# Altium project Otto.PrjPcb
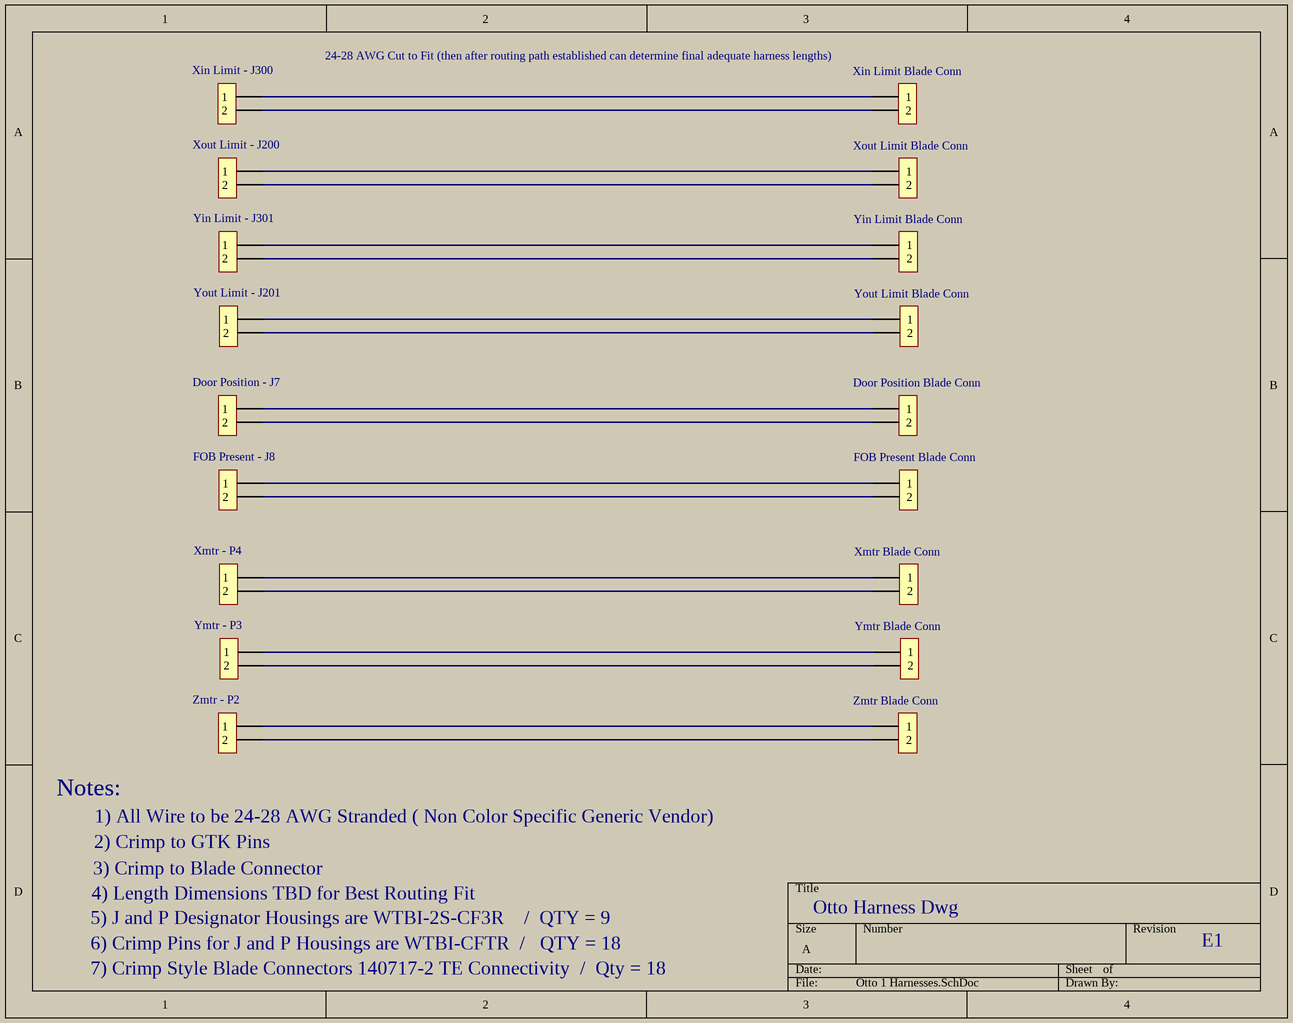
[diagram p0: Otto 1 Harnesses.SchDoc]
3 sheets, 159 parts. Net scope: flat (ports and power ports of the same name join across sheets).
Board file: OTTO.PcbDoc
Sheets:
  Otto 1 Harnesses.SchDoc
  Otto 2.SchDoc
  Otto 1.SchDoc

## Sheet Otto 1 Harnesses.SchDoc
size A

### Parts
Door_Position_-_J7  1mm 2 pin Housing  (value not drawn)
Door_Position_Blade_Conn  Crimp Blade Conn  [GTK-2]  (value not drawn)
FOB_Present_-_J8  1mm 2 pin Housing  (value not drawn)
FOB_Present_Blade_Conn  Crimp Blade Conn  [GTK-2]  (value not drawn)
Xin_Limit_-_J300  1mm 2 pin Housing  (value not drawn)
Xin_Limit_Blade_Conn  Crimp Blade Conn  [GTK-2]  (value not drawn)
Xmtr_-_P4  1mm 2 pin Housing  (value not drawn)
Xmtr_Blade_Conn  Crimp Blade Conn  [GTK-2]  (value not drawn)
Xout_Limit_-_J200  1mm 2 pin Housing  (value not drawn)
Xout_Limit_Blade_Conn  Crimp Blade Conn  [GTK-2]  (value not drawn)
Yin_Limit_-_J301  1mm 2 pin Housing  (value not drawn)
Yin_Limit_Blade_Conn  Crimp Blade Conn  [GTK-2]  (value not drawn)
Ymtr_-_P3  1mm 2 pin Housing  (value not drawn)
Ymtr_Blade_Conn  Crimp Blade Conn  [GTK-2]  (value not drawn)
Yout_Limit_-_J201  1mm 2 pin Housing  (value not drawn)
Yout_Limit_Blade_Conn  Crimp Blade Conn  [GTK-2]  (value not drawn)
Zmtr_-_P2  1mm 2 pin Housing  (value not drawn)
Zmtr_Blade_Conn  Crimp Blade Conn  [GTK-2]  (value not drawn)

### Nets
NetDoor_Position_-_J7_1: Door_Position_-_J7.1 Door_Position_Blade_Conn.1
NetDoor_Position_-_J7_2: Door_Position_-_J7.2 Door_Position_Blade_Conn.2
NetFOB_Present_-_J8_1: FOB_Present_-_J8.1 FOB_Present_Blade_Conn.1
NetFOB_Present_-_J8_2: FOB_Present_-_J8.2 FOB_Present_Blade_Conn.2
NetXin_Limit_-_J300_1: Xin_Limit_-_J300.1 Xin_Limit_Blade_Conn.1
NetXin_Limit_-_J300_2: Xin_Limit_-_J300.2 Xin_Limit_Blade_Conn.2
NetXmtr_-_P4_1: Xmtr_-_P4.1 Xmtr_Blade_Conn.1
NetXmtr_-_P4_2: Xmtr_-_P4.2 Xmtr_Blade_Conn.2
NetXout_Limit_-_J200_1: Xout_Limit_-_J200.1 Xout_Limit_Blade_Conn.1
NetXout_Limit_-_J200_2: Xout_Limit_-_J200.2 Xout_Limit_Blade_Conn.2
NetYin_Limit_-_J301_1: Yin_Limit_-_J301.1 Yin_Limit_Blade_Conn.1
NetYin_Limit_-_J301_2: Yin_Limit_-_J301.2 Yin_Limit_Blade_Conn.2
NetYmtr_-_P3_1: Ymtr_-_P3.1 Ymtr_Blade_Conn.1
NetYmtr_-_P3_2: Ymtr_-_P3.2 Ymtr_Blade_Conn.2
NetYout_Limit_-_J201_1: Yout_Limit_-_J201.1 Yout_Limit_Blade_Conn.1
NetYout_Limit_-_J201_2: Yout_Limit_-_J201.2 Yout_Limit_Blade_Conn.2
NetZmtr_-_P2_1: Zmtr_-_P2.1 Zmtr_Blade_Conn.1
NetZmtr_-_P2_2: Zmtr_-_P2.2 Zmtr_Blade_Conn.2

### Notes on the sheet
- (near Xin_Limit_Blade_Conn) 24-28 AWG Cut to Fit (then after routing path established can determine final adequate harness lengths)
- Notes:
- 1) All Wire to be 24-28 AWG Stranded ( Non Color Specific Generic Vendor)
- 4) Length Dimensions TBD for Best Routing Fit
- 3) Crimp to Blade Connector
- 2) Crimp to GTK Pins
- 5) J and P Designator Housings are WTBI-2S-CF3R    /  QTY = 9
- 6) Crimp Pins for J and P Housings are WTBI-CFTR  /   QTY = 18
- 7) Crimp Style Blade Connectors 140717-2 TE Connectivity  /  Qty = 18
- Otto Harness Dwg
- E1

### Library data of the parts
Door_Position_-_J7 FOB_Present_-_J8 Xin_Limit_-_J300 Xmtr_-_P4 Xout_Limit_-_J200 Yin_Limit_-_J301 Ymtr_-_P3 Yout_Limit_-_J201 Zmtr_-_P2 = 2 PIN .1mm GTK Header: WTBI-02S-CF3R  2pin 1mm center GTK Housing
Door_Position_Blade_Conn FOB_Present_Blade_Conn Xin_Limit_Blade_Conn Xmtr_Blade_Conn Xout_Limit_Blade_Conn Yin_Limit_Blade_Conn Ymtr_Blade_Conn Yout_Limit_Blade_Conn Zmtr_Blade_Conn = 2 PIN .1mm GTK Header: 140717-2 TE Connectivity

## Sheet Otto 2.SchDoc
size B
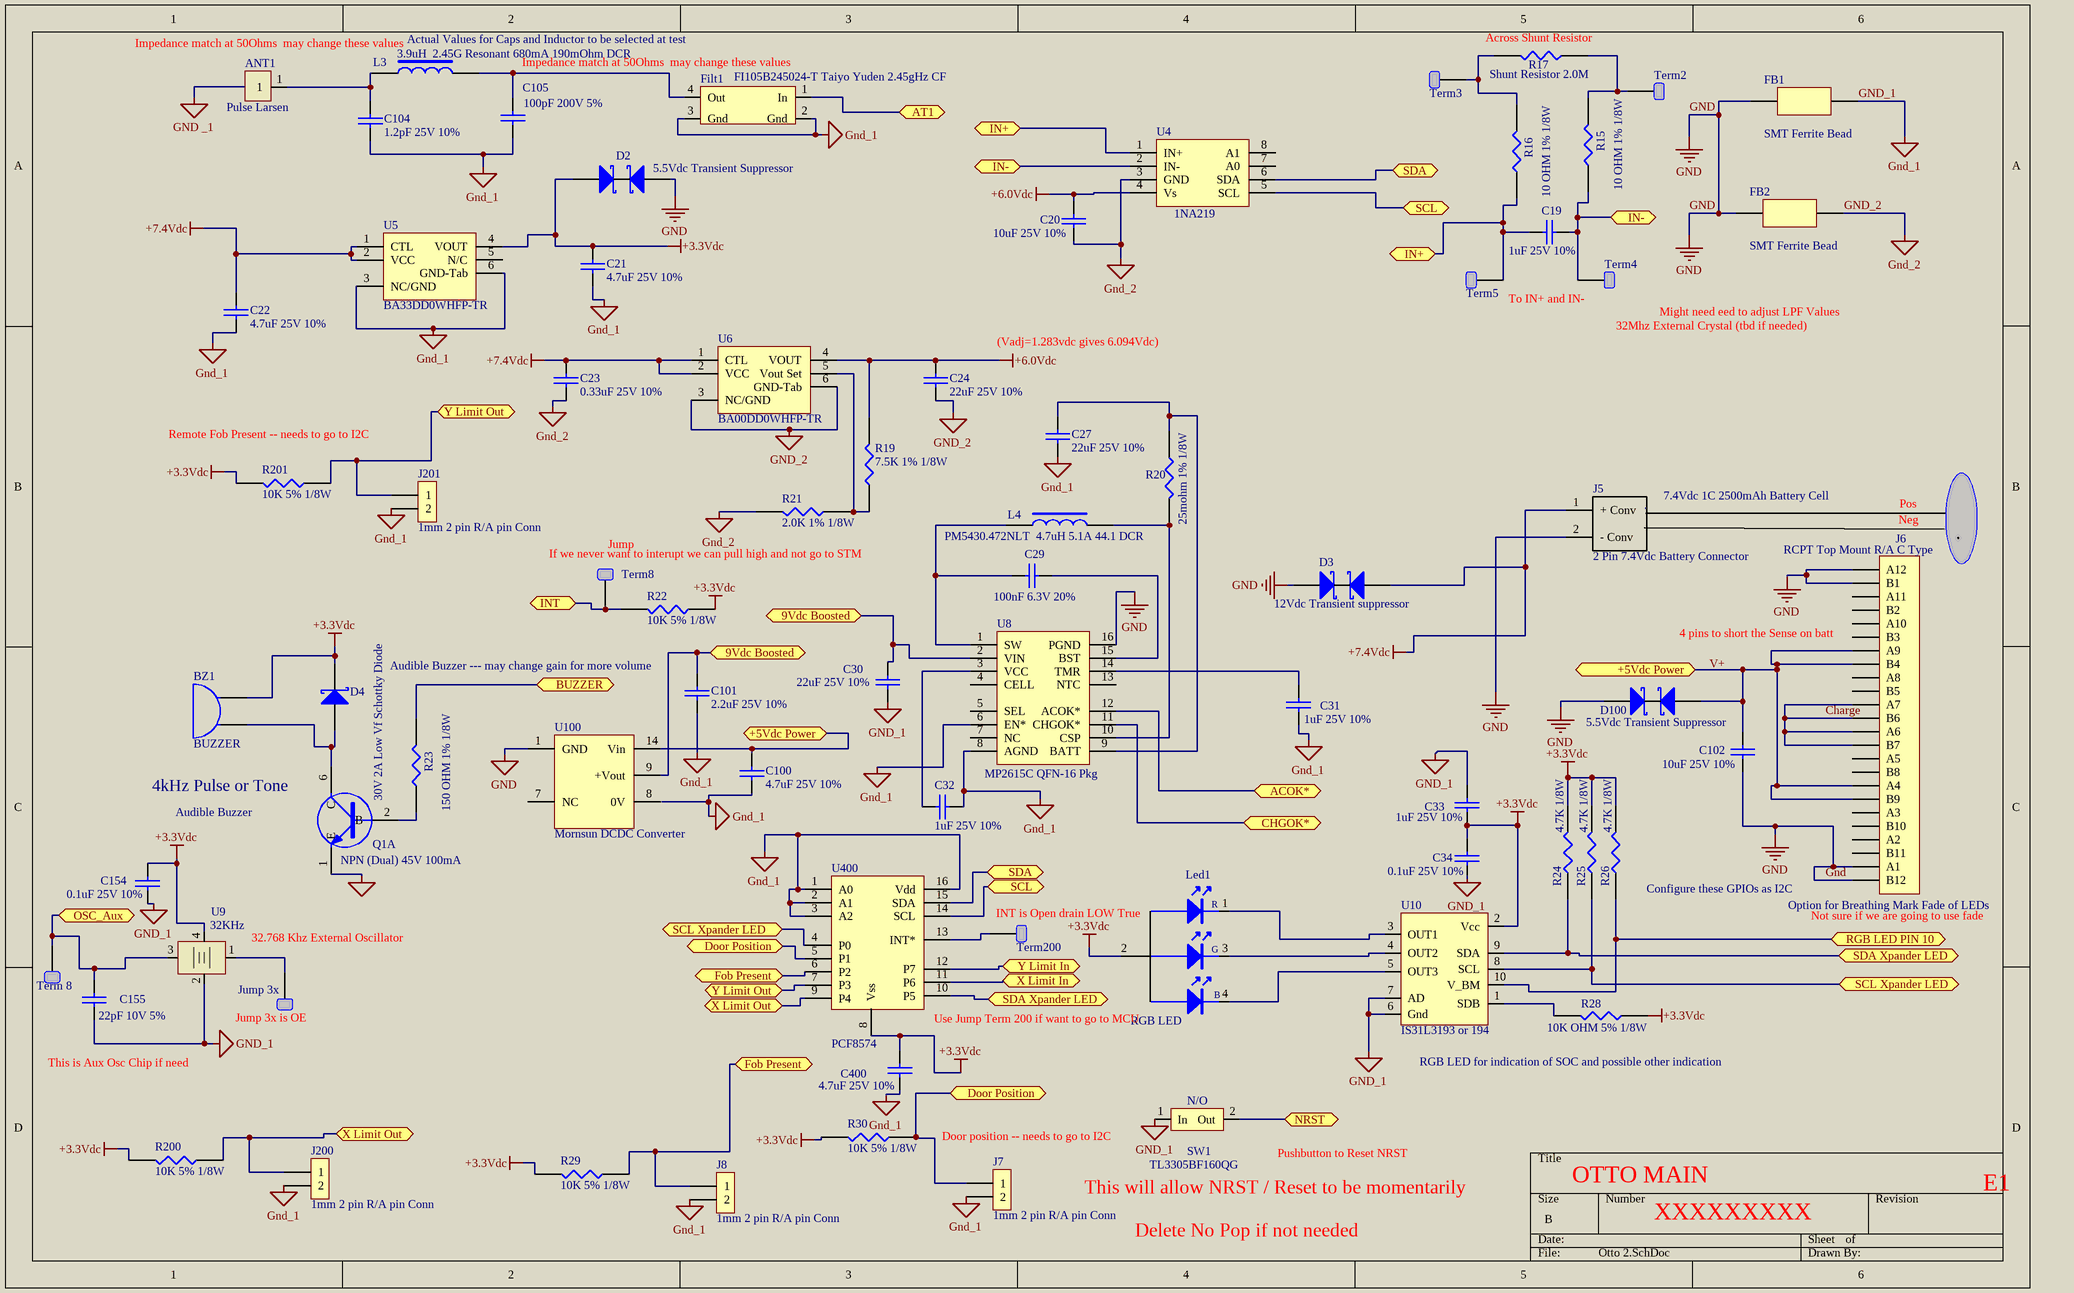
[diagram p1: Otto 2.SchDoc]

### Parts
ANT1  Pulse Larsen  [Pulse Larsen - duplicate]
BZ1  BUZZER  [BUZZER-smd]
C19  1uF 25V 10%  [0603]
C20  10uF 25V 10%  [BEADC3225X280N]
C21  4.7uF 25V 10%  [0603]
C22  4.7uF 25V 10%  [0603]
C23  0.33uF 25V 10%  [0603]
C24  22uF 25V 10%  [C1210]
C27  22uF 25V 10%  [C1210]
C29  100nF 6.3V 20%  [0603]
C30  22uF 25V 10%  [C1210]
C31  1uF 25V 10%  [0603]
C32  1uF 25V 10%  [0603]
C33  1uF 25V 10%  [0603]
C34  0.1uF 25V 10%  [0402]
C100  4.7uF 25V 10%  [0603]
C101  2.2uF 25V 10%  [0603]
C102  10uF 25V 10%  [BEADC3225X280N]
C104  1.2pF 25V 10%  [0402]
C105  100pF 200V 5%  [0603]
C154  0.1uF 25V 10%  [0402]
C155  22pF 10V 5%  [0805]
C400  4.7uF 25V 10%  [0603]
D2  5.5Vdc Transient Suppressor  [TDK-TVS]
D3  12Vdc Transient suppressor  [VS12BA-TVS]
D4  30V 2A Low Vf Schottky Diode  [SOD 123]
D100  5.5Vdc Transient Suppressor  [TDK-TVS]
FB1  Max DCR 0.05ohm  3A  [0805]  (value not drawn)
FB2  Max DCR 0.05ohm  3A  [0805]  (value not drawn)
Filt1  FI105B245024-T Taiyo Yuden 2.45gHz CF  [Filter]
J5  2 Pin 7.4Vdc Battery Connector  [GTK 2 pin Batt  RA]
J6  RCPT Top Mount R/A C Type  [C-Conn]
J7  1mm 2 pin R/A pin Conn  [GTK-2]
J8  1mm 2 pin R/A pin Conn  [GTK-2]
J200  1mm 2 pin R/A pin Conn  [GTK-2]
J201  1mm 2 pin R/A pin Conn  [GTK-2]
Jump_3x  Hook Up Terminal  [Pad]  (value not drawn)
L3  3.9uH  2.45G Resonant 680mA 190mOhm DCR  [0603]
L4  PM5430.472NLT  4.7uH 5.1A 44.1 DCR  [Pulse 3A5430]
Led1  RGB LED  [4P RGB LED]
Q1  NPN (Dual) 45V 100mA  [SOT-363]  (part A of 2)
R15  10 OHM 1% 1/8W  [0805]
R16  10 OHM 1% 1/8W  [0805]
R17  Shunt Resistor 2.0M  [2512]
R19  7.5K 1% 1/8W  [0805]
R20  25mohm 1% 1/8W  [0805]
R21  2.0K 1% 1/8W  [0805]
R22  10K 5% 1/8W  [0805]
R23  150 OHM 1% 1/8W  [0805]
R24  4.7K 1/8W  [0805]
R25  4.7K 1/8W  [0805]
R26  4.7K 1/8W  [0805]
R28  10K OHM 5% 1/8W  [0805]
R29  10K 5% 1/8W  [0805]
R30  10K 5% 1/8W  [0805]
R200  10K 5% 1/8W  [0805]
R201  10K 5% 1/8W  [0805]
SW1  TL3305BF160QG  [Switch]
Term2  Hook Up Terminal  [Pad]  (value not drawn)
Term3  Hook Up Terminal  [Pad]  (value not drawn)
Term4  Hook Up Terminal  [Pad]  (value not drawn)
Term5  Hook Up Terminal  [Pad]  (value not drawn)
Term8  Hook Up Terminal  [Pad]  (value not drawn)
Term200  Hook Up Terminal  [Pad]  (value not drawn)
Term_8  Hook Up Terminal  [Pad]  (value not drawn)
U4  1NA219  [INA219]
U5  BA33DD0WHFP-TR  [HRP-5]
U6  BA00DD0WHFP-TR  [HRP-5]
U8  MP2615C QFN-16 Pkg  [QFN-16]
U9  32KHz  [XTAL AND OSC]
U10  IS31L3193 or 194  [DFN-10]
U100  Mornsun DCDC Converter  [B0509D-2WR3]
U400  PCF8574  [SOIC-16]

### Ports
9Vdc Boosted (bidir), +5Vdc Power (bidir), ACOK* (bidir), AT1 (bidir), BUZZER (bidir), CHGOK* (bidir), Door Position (bidir), Fob Present, Fob Present (bidir), IN+ (bidir), IN- (bidir), INT (bidir), NRST (bidir), OSC_Aux (bidir), RGB LED PIN 10 (bidir), SCL (bidir), SCL Xpander LED (bidir), SDA (bidir), SDA Xpander LED (bidir), X Limit In (bidir), X Limit Out (bidir), Y Limit In (bidir), Y Limit Out (bidir)

### Nets
+3.3Vdc: BZ1.2(B) C21.2 C33.2 C34.1 C154.1 C400.2 D2.1 D4.1 Led1.2 R22.1 R24.2 R25.2 R26.2 R28.2 R29.2 R30.2 R200.2 R201.2 U5.4(VOUT) U9.4 U10.2(Vcc) U400.8(Vss)
+6.0Vdc: C20.1 C24.2 R19.2 U4.4(Vs) U6.4(VOUT)
+7.4Vdc: C22.2 C23.2 D3.2 J5.1(+_Conv) U5.1(CTL) U5.2(VCC) U6.1(CTL) U6.2(VCC)
GND: C102.2 D2.2 D3.1 D100.1 FB1.1 FB2.1 J5.2(-_Conv) J6.A1 J6.A12 J6.B1 J6.B12 U8.16(PGND) U100.1(GND)
GND_1: C21.1 C22.1 C27.1 C30.1 C31.2 C32.2 C33.1 C34.2 C100.1 C101.1 C104.2 C105.2 C154.2 C155.2 C400.1 FB1.2 Filt1.2(Gnd) Filt1.3(Gnd) J7.2 J8.2 J200.2 J201.2 Q1.1(E) SW1.1(In) U5.3(NC/GND) U5.6(GND-Tab) U8.6(EN*) U8.8(AGND) U9.2 U10.6(Gnd) U10.7(AD) U400.1(A0) U400.2(A1) U400.3(A2) U400.16(Vdd)
GND_2: C20.2 C23.1 C24.1 FB2.2 R21.2 U4.3(GND) U6.3(NC/GND) U6.6(GND-Tab)
Charge: J6.A6 J6.A7 J6.B6 J6.B7
NetANT1_1: ANT1.1 C104.1 L3.1
NetBZ1_1: BZ1.1(A) D4.2 Q1.6(C)
NetC14_1: SW1.2(Out) ; port NRST
NetC19_1: C19.1 R16.1 Term5.1 U4.1(IN+) ; port IN+
NetC19_2: C19.2 R15.1 Term4.1 U4.2(IN-) ; port IN-
NetC27_2: C27.2 R20.1 U8.9(BATT)
NetC29_1: C29.1 U8.15(BST)
NetC29_2: C29.2 L4.1 U8.1(SW)
NetC30_2: C30.2 C101.2 U8.2(VIN) U100.9(+Vout) ; port 9Vdc Boosted
NetC31_1: C31.1 U8.14(TMR)
NetC32_1: C32.1 U8.3(VCC)
NetC100_2: C100.2 C102.1 D100.2 J6.A4 J6.A9 J6.B4 J6.B9 U100.14(Vin) ; port +5Vdc Power
NetC105_1: C105.1 Filt1.4(Out) L3.2
NetC155_1: C155.1 Term_8.1 U9.3 ; port OSC_Aux
NetFilt1_1: Filt1.1(In) ; port AT1
NetJ7_1: J7.1 R30.1 U400.5(P1) ; port Door Position
NetJ8_1: J8.1 R29.1 U400.6(P2) ; port Fob Present
NetJ200_1: J200.1 R200.1 U400.9(P4) ; port X Limit Out
NetJ201_1: J201.1 R201.1 U400.7(P3) ; port Y Limit Out
NetJ300_1: U400.11(P6) ; port X Limit In
NetJ301_1: U400.12(P7) ; port Y Limit In
NetJump_3x_1: Jump_3x.1 U9.1
NetL4_2: L4.2 R20.2 U8.10(CSP)
NetLed1_1: Led1.1(R) U10.3(OUT1)
NetLed1_3: Led1.3(G) U10.4(OUT2)
NetLed1_4: Led1.4(G) U10.5(OUT3)
NetQ1_2: Q1.2(B) R23.1
NetR15_2: R15.2 R17.1 Term2.1
NetR16_2: R16.2 R17.2 Term3.1
NetR19_1: R19.1 R21.1 U6.5(Vout_Set)
NetR22_2: R22.2 Term8.1 ; port INT
NetR23_2: R23.2 ; port BUZZER
NetR24_1: R24.1 U10.9(SDA) U400.10(P5) ; port SDA Xpander LED
NetR25_1: R25.1 U10.8(SCL) U400.4(P0) ; port SCL Xpander LED
NetR26_1: R26.1 U10.10(V_BM) ; port RGB LED PIN 10
NetR28_1: R28.1 U10.1(SDB)
NetTerm200_1: Term200.1 U400.13(INT*)
NetU1_16: U4.5(SCL) U400.14(SCL) ; port SCL
NetU1_17: U8.11(CHGOK*) ; port CHGOK*
NetU1_44: U4.6(SDA) U400.15(SDA) ; port SDA
NetU1_45: U8.12(ACOK*) ; port ACOK*

Not connected (* = marked no-connect by the designer): J6 A2 A3 A5 A8 A10 A11 B2 B3 B5 B8 B10 B11; U4 7(A0) 8(A1); U5 5(N/C); U8 4(CELL) 5(SEL) 7(NC) 13(NTC); U100 7(NC) 8(0V)

### Notes on the sheet
- Impedance match at 50Ohms  may change these values
- (near L3) Actual Values for Caps and Inductor to be selected at test
- (near R17) Across Shunt Resistor
- (near Term4) To IN+ and IN-
- (Vadj=1.283vdc gives 6.094Vdc)
- (near Term4) 32Mhz External Crystal (tbd if needed)
- Might need eed to adjust LPF Values
- Remote Fob Present -- needs to go to I2C
- 7.4Vdc 1C 2500mAh Battery Cell
- Pos
- (near Term8) If we never want to interupt we can pull high and not go to STM
- (near Term8) Jump
- (near J6) Neg
- (near J6) 4 pins to short the Sense on batt
- (near C101) Audible Buzzer --- may change gain for more volume
- (near Q1) 4kHz Pulse or Tone
- Audible Buzzer
- (near R26) Configure these GPIOs as I2C
- (near J6) Option for Breathing Mark Fade of LEDs
- (near U9) 32.768 Khz External Oscillator
- (near Led1) INT is Open drain LOW True
- (near J6) Not sure if we are going to use fade
- (near Jump_3x) Jump 3x is OE
- Use Jump Term 200 if want to go to MCU
- (near C155) This is Aux Osc Chip if need
- RGB LED for indication of SOC and possible other indication
- (near SW1) Door position -- needs to go to I2C
- Pushbutton to Reset NRST
- This will allow NRST / Reset to be momentarily
- Delete No Pop if not needed
- OTTO MAIN
- XXXXXXXXX
- E1
- Labels drawn without touching a wire or pin: V+
- (in symbol RGB LED) B
- (in symbol SPSP Switch) N/O

### Library data of the parts
ANT1 = ANT: W3230 Pulse Larsen BLE 2.5Ghz 2.57 at Digikey
BZ1 = BUZZER: KLJ-5030 (Keliking) 4kHz Buzzer 71 cents from LcSc.com
C19 C31-C33 = CAP: CC0603KRX5R8BB105 1uf 25V 10% Yageo 3 cents at Mouser
C20 C102 = CAP: CC1210KFX7R8BB106 Yageo 10uF 25V 10% 23 cents at Mouser
C21 C22 C100 C400 = CAP: GRM188R61E475KE11D Murata 4.7uF 25V 10% 7.9 centsat Mouser
C23 = CAP: C1608X7R1E334K080AC 0.33uF 25V 10% 2.8 cents at Mouser
C24 C27 C30 = CAP: TMK325B7226KM8P Taito Uden 22uF 25V X7R 10%    47cents at Mouser
C29 = CAP: 06036C104MAZ2A Kyocera 100nf 6.3V 20% 12 cents at Mouse
C34 C154 = CAP: TMK105BJ104KV8F Taiyo Uden 0.1uF 25V 10% 2.3 cents at Mouser
C101 = CAP: GRM188C71E225KE11J 2.2uF 25V 10% 0.19 usd @digikey
C104 = CAP: VJ0402A1R2BXXCW1BC  Vishay 13 cents at Mouser
C105 = CAP: C0603C101J2GACAUTO Kemet 5% 200V 0603 12 cents at Mouser
C155 = CAP: C0805C220J8GACAUTO Kemet 0805 22pF 5% 7 cents at Mouser
D2 D100 = X1-DFN1006-2: B74111U0055M060  TDK 5.5vdc Supressor 3cents at Mouser
D3 = VS12VBA1HST15R: VS12VBA1HST15R  Rohm 12Vdc Transient Supressor 5cents at Digikey
D4 = DIODE SCHOTTKY: MBR230LSFT1G On Semi 2A 30V Diode SOD 123 23 cents at Newark
FB1 FB2 = FERRITE BEAD: 2508051217Z3 (Fair-Rite) 4.8 cents at Mouser; Text Field1: SMT Ferrite Bead
Filt1 = Filter RF: FI105B245024-T Taiyo Uuden RF 2.45gHz  Filter 4 pin smd 37 cents at Digikey
J5 = 2 PIN .1"  HDR: 640457-2  TE Connectivity 2 pin r-a battery conn 8.6cents at Mouser
J6 = C-Type Conn: USB3CF24M-H05 (HJC Conectors)
J7 J8 J200 J201 = 2 PIN .1mm GTK Receptacle_1: WTBI-02S-CF3-R 5 pin R-A 1mm center GTK Receptacle
L3 = INDUCTOR2: 0603HP-39NXGLU CoilCraft  190mOhm 680mA 2.45Ghz Resonant
L4 = INDUCTOR2: PM5430.472NLT  4.7uH 5.1A 44.1 DCR Ohms 20% 80 Cents at Digikey
Led1 = RGB LED: 521-8559F Dialight $p RGB 5mm Common Anode through hole 26 cents at Mouser
Q1 = SOT-363: BC847BS,115 Nexperia Dual NPN 8.9cents at Mouser
R15 R16 = RES1: CMP0805-FX-10R0ELF Bournes 10 ohm 1% .125 2.4 cents at Mouser
R17 = RES1: PSR100KTQFJ2L00 64cents at Mouser
R19 = RES1: KTR10EZPF7501 Rohm 7,5K 1% 3 cents at Mouser
R20 = RES1: CRF0805-FZ-R025ELF 25mohm 1% Current Shunt Resistor 16 cents at Mouser
R21 = RES1: SDR10EZPF2001 Rohm 2.0k 1% 2.1 cents at Mouser
R22 R29 R30 R200 R201 = RES1: CRCW080510K0JNEAC  5% .125 .8cents at Mouser
R23 = RES1: RC0805FR-07150RL  Yageo 150ohm 1% .125 1.6 cents at Digikey
R24-R26 = RES1: RC0805JR-074K7L Yageo 4.7K .125 10% 11 cents at Mouser
R28 = RES1: R0805JR-0710KL Yageo 10k .125 5% 27 cents at Digikey
SW1 = SPSP Switch: TL3305BF160QG SPST E-Switch Pushbutton Normally Open Tactile 1.5cents at Mouser
U4 = 1NA219: INA219AIDCNR Current Sensor  1.29 sd at mouser
U5 = 3.3 Fixed LDO: BA33DD0WHFP-TR 3.3Vdc LDO Rohm 2.15 usd at mouser
U6 = 6.0 Vdc LDO: BA00DD0WHFP-TR 6.0Vdc LDO Rohm  1.24 usd at mouser
U8 = MP2615C: MP2615C Batt Charger IC usd at mouser
U9 = XTAL: Pericom 3270004 32KhZ
U10 = IS31FL3193 RGB Drive: IS31FL3194-CLS2-TR RGB Driver 62 cents at Mouser also look at IS31FL3193 part
U100 = B0509D- 2WR3: B0509D- 2WR3  DC to DC Boost 5 to 9Vdc 2.80 at Digikey
U400 = PCF8574: PCF8574 I2C Expander  fix   usd at mouser

## Sheet Otto 1.SchDoc
size B
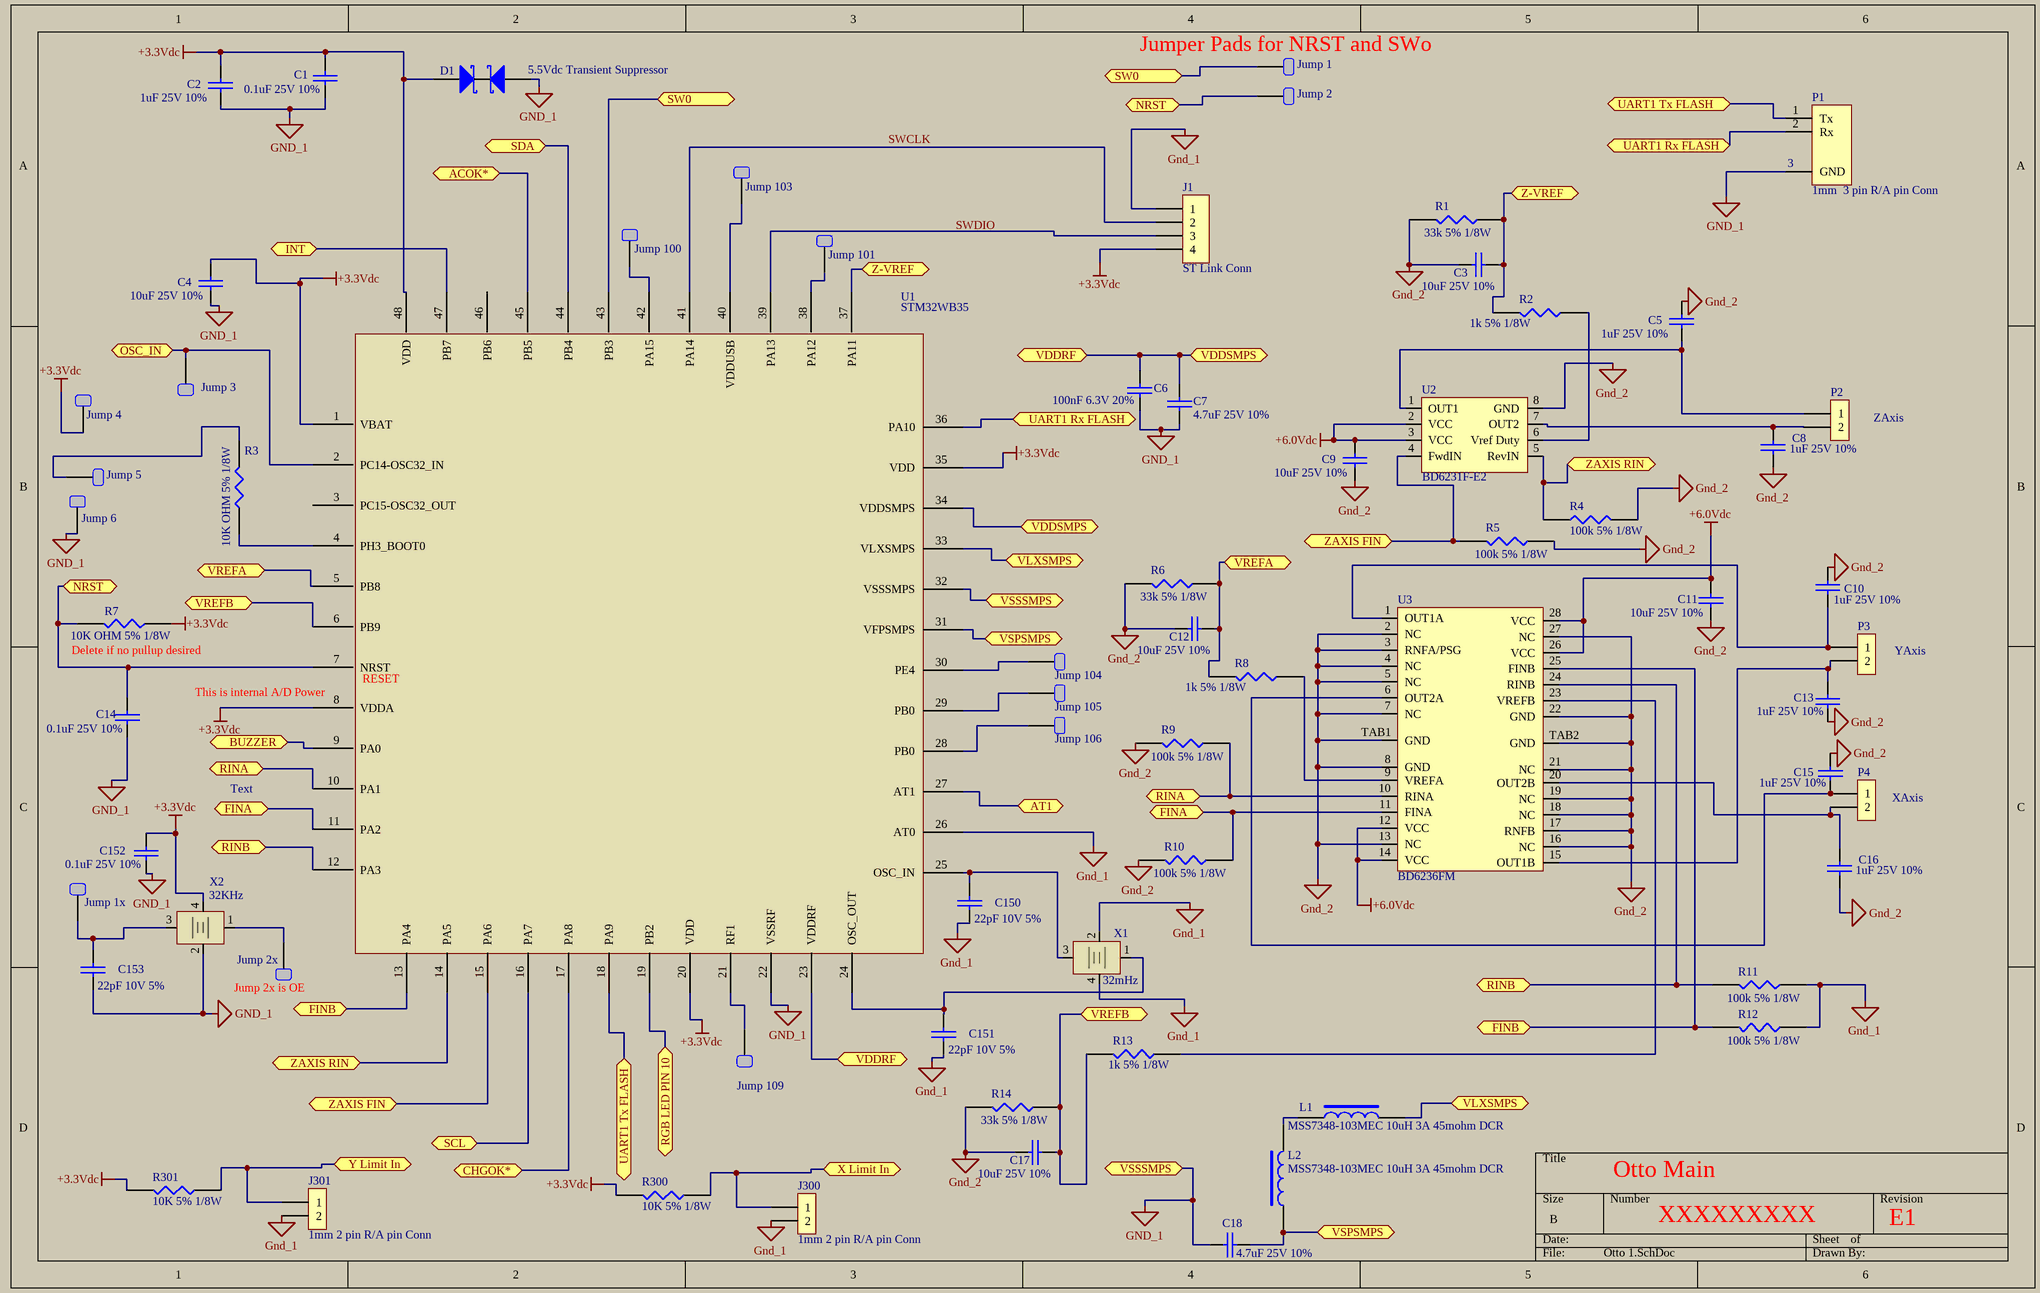
[diagram p2: Otto 1.SchDoc]

### Parts
C1  0.1uF 25V 10%  [0402]
C2  1uF 25V 10%  [0603]
C3  10uF 25V 10%  [BEADC3225X280N]
C4  10uF 25V 10%  [BEADC3225X280N]
C5  1uF 25V 10%  [0603]
C6  100nF 6.3V 20%  [0603]
C7  4.7uF 25V 10%  [0603]
C8  1uF 25V 10%  [0603]
C9  10uF 25V 10%  [BEADC3225X280N]
C10  1uF 25V 10%  [0603]
C11  10uF 25V 10%  [BEADC3225X280N]
C12  10uF 25V 10%  [BEADC3225X280N]
C13  1uF 25V 10%  [0603]
C14  0.1uF 25V 10%  [0402]
C15  1uF 25V 10%  [0603]
C16  1uF 25V 10%  [0603]
C17  10uF 25V 10%  [BEADC3225X280N]
C18  4.7uF 25V 10%  [0603]
C150  22pF 10V 5%  [0805]
C151  22pF 10V 5%  [0805]
C152  0.1uF 25V 10%  [0402]
C153  22pF 10V 5%  [0805]
D1  5.5Vdc Transient Suppressor  [TDK-TVS]
J1  ST Link Conn  [CONN-4]
J300  1mm 2 pin R/A pin Conn  [GTK-2]
J301  1mm 2 pin R/A pin Conn  [GTK-2]
Jump_1  Hook Up Terminal  [Pad]  (value not drawn)
Jump_1x  Hook Up Terminal  [Pad]  (value not drawn)
Jump_2  Hook Up Terminal  [Pad]  (value not drawn)
Jump_2x  Hook Up Terminal  [Pad]  (value not drawn)
Jump_3  Hook Up Terminal  [Pad]  (value not drawn)
Jump_4  Hook Up Terminal  [Pad]  (value not drawn)
Jump_5  Hook Up Terminal  [Pad]  (value not drawn)
Jump_6  Hook Up Terminal  [Pad]  (value not drawn)
Jump_100  Hook Up Terminal  [Pad]  (value not drawn)
Jump_101  Hook Up Terminal  [Pad]  (value not drawn)
Jump_103  Hook Up Terminal  [Pad]  (value not drawn)
Jump_104  Hook Up Terminal  [Pad]  (value not drawn)
Jump_105  Hook Up Terminal  [Pad]  (value not drawn)
Jump_106  Hook Up Terminal  [Pad]  (value not drawn)
Jump_109  Hook Up Terminal  [Pad]  (value not drawn)
L1  MSS7348-103MEC 10uH 3A 45mohm DCR  [Coilcraft 7x7 Inductor]
L2  MSS7348-103MEC 10uH 3A 45mohm DCR  [Coilcraft 7x7 Inductor]
P1  1mm  3 pin R/A pin Conn  [GTK 3pin 1mm Header]
P2  1mm 2 pin R/A pin Conn  [GTK-2]  (value not drawn)
P3  1mm 2 pin R/A pin Conn  [GTK-2]  (value not drawn)
P4  1mm 2 pin R/A pin Conn  [GTK-2]  (value not drawn)
R1  33k 5% 1/8W  [0805]
R2  1k 5% 1/8W  [0805]
R3  10K OHM 5% 1/8W  [0805]
R4  100k 5% 1/8W  [0805]
R5  100k 5% 1/8W  [0805]
R6  33k 5% 1/8W  [0805]
R7  10K OHM 5% 1/8W  [0805]
R8  1k 5% 1/8W  [0805]
R9  100k 5% 1/8W  [0805]
R10  100k 5% 1/8W  [0805]
R11  100k 5% 1/8W  [0805]
R12  100k 5% 1/8W  [0805]
R13  1k 5% 1/8W  [0805]
R14  33k 5% 1/8W  [0805]
R300  10K 5% 1/8W  [0805]
R301  10K 5% 1/8W  [0805]
U1  STM32WB35  [QFN50P700X700X65-49N-D]
U2  BD6231F-E2  [SOP-8]
U3  BD6236FM  [HSOP-M28]
X1  32mHz  [XTAL AND OSC]
X2  32KHz  [XTAL AND OSC]

### Ports
ACOK* (bidir), AT1 (bidir), BUZZER (bidir), CHGOK* (bidir), FINA (bidir), FINB (bidir), INT (bidir), NRST (bidir), OSC_IN (bidir), RGB LED PIN 10 (bidir), RINA (bidir), RINB (bidir), SCL (bidir), SDA (bidir), SW0 (bidir), UART1 Rx FLASH (bidir), UART1 Tx FLASH (bidir), VDDRF (bidir), VDDSMPS (bidir), VLXSMPS (bidir), VREFA (bidir), VREFB (bidir), VSPSMPS (bidir), VSSSMPS (bidir), X Limit In (bidir), Y Limit In (bidir), Z-VREF (bidir), ZAXIS FIN (bidir), ZAXIS RIN (bidir)

### Nets
+3.3Vdc: C1.1 C2.1 C4.1 C152.1 D1.1 J1.4 Jump_4.1 R7.2 R300.2 R301.2 U1.1(VBAT) U1.8(VDDA) U1.20(VDD) U1.35(VDD) U1.48(VDD) X2.4
+6.0Vdc: C9.1 C11.1 U2.2(VCC) U2.3(VCC) U3.12(VCC) U3.14(VCC) U3.26(VCC) U3.28(VCC)
GND_1: C1.2 C2.2 C4.2 C6.2 C7.1 C14.2 C18.1 C150.2 C151.2 C152.2 C153.2 D1.2 J1.1 J300.2 J301.2 Jump_6.1 P1.2(GND) R11.1 R12.1 U1.22(VSSRF) U1.26(AT0) U1.32(VSSSMPS) X1.2 X1.4 X2.2 ; port VSSSMPS
GND_2: C3.1 C5.1 C8.2 C9.2 C10.1 C11.2 C12.1 C13.2 C15.1 C16.2 C17.1 R1.2 R4.2 R5.1 R6.2 R9.2 R10.2 R14.2 U2.8(GND) U3.2(NC) U3.3(RNFA/PSG) U3.4(NC) U3.5(NC) U3.7(NC) U3.8(GND) U3.13(NC) U3.16(NC) U3.17(RNFB) U3.18(NC) U3.19(NC) U3.21(NC) U3.22(GND) U3.27(NC) U3.TAB1(GND) U3.TAB2(GND)
SWCLK: J1.2 U1.41(PA14)
NetC3_2: C3.2 R1.1 R2.2 U1.37(PA11) ; port Z-VREF
NetC5_2: C5.2 P2.1 U2.1(OUT1)
NetC6_1: C6.1 C7.2 U1.23(VDDRF) U1.34(VDDSMPS) ; port VDDSMPS, port VDDRF
NetC8_1: C8.1 P2.2 U2.7(OUT2)
NetC10_2: C10.2 P3.1 U3.1(OUT1A)
NetC12_2: C12.2 R6.1 R8.2 U1.5(PB8) ; port VREFA
NetC13_1: C13.1 P3.2 U3.15(OUT1B)
NetC14_1: C14.1 Jump_2.1 R7.1 U1.7(NRST) ; port NRST
NetC15_2: C15.2 P4.1 U3.6(OUT2A)
NetC16_1: C16.1 P4.2 U3.20(OUT2B)
NetC17_2: C17.2 R13.2 R14.1 U1.6(PB9) ; port VREFB
NetC18_2: C18.2 L2.1 U1.31(VFPSMPS) ; port VSPSMPS
NetC150_1: C150.1 U1.25(OSC_IN) X1.3
NetC151_1: C151.1 U1.24(OSC_OUT) X1.1
NetC153_1: C153.1 Jump_1x.1 X2.3
NetFilt1_1: U1.27(AT1) ; port AT1
NetJ1_3: J1.3 U1.39(PA13)
NetJ300_1: J300.1 R300.1 ; port X Limit In
NetJ301_1: J301.1 R301.1 ; port Y Limit In
NetJump_1_1: Jump_1.1 U1.43(PB3) ; port SW0
NetJump_2x_1: Jump_2x.1 X2.1
NetJump_3_1: Jump_3.1 U1.2(PC14-OSC32_IN) ; port OSC_IN
NetJump_5_1: Jump_5.1 R3.1
NetJump_100_1: Jump_100.1 U1.42(PA15)
NetJump_101_1: Jump_101.1 U1.38(PA12)
NetJump_103_1: Jump_103.1 U1.40(VDDUSB)
NetJump_104_1: Jump_104.1 U1.30(PE4)
NetJump_105_1: Jump_105.1 U1.29(PB0)
NetJump_106_1: Jump_106.1 U1.28(PB0)
NetJump_109_1: Jump_109.1 U1.21(RF1)
NetL1_1: L1.1 L2.2
NetL1_2: L1.2 U1.33(VLXSMPS) ; port VLXSMPS
NetP1_1: P1.1(Tx) U1.18(PA9) ; port UART1 Tx FLASH
NetP1_2: P1.2(Rx) U1.36(PA10) ; port UART1 Rx FLASH
NetR2_1: R2.1 U2.6(Vref_Duty)
NetR3_2: R3.2 U1.4(PH3_BOOT0)
NetR4_1: R4.1 U1.14(PA5) U2.5(RevIN) ; port ZAXIS RIN
NetR5_2: R5.2 U1.15(PA6) U2.4(FwdIN) ; port ZAXIS FIN
NetR8_1: R8.1 U3.9(VREFA)
NetR9_1: R9.1 U1.10(PA1) U3.10(RINA) ; port RINA
NetR10_1: R10.1 U1.11(PA2) U3.11(FINA) ; port FINA
NetR11_2: R11.2 U1.12(PA3) U3.24(RINB) ; port RINB
NetR12_2: R12.2 U1.13(PA4) U3.25(FINB) ; port FINB
NetR13_1: R13.1 U3.23(VREFB)
NetR22_2: U1.47(PB7) ; port INT
NetR23_2: U1.9(PA0) ; port BUZZER
NetR26_1: U1.19(PB2) ; port RGB LED PIN 10
NetU1_16: U1.16(PA7) ; port SCL
NetU1_17: U1.17(PA8) ; port CHGOK*
NetU1_44: U1.44(PB4) ; port SDA
NetU1_45: U1.45(PB5) ; port ACOK*

Not connected (* = marked no-connect by the designer): U1 3(PC15-OSC32_OUT) 46(PB6)

### Notes on the sheet
- (near Jump_1) Jumper Pads for NRST and SWo
- (near P1) 3
- (near P2) ZAxis
- (near R7) Delete if no pullup desired
- (near U1) This is internal A/D Power
- (near U1) RESET
- (near P3) YAxis
- Text
- (near P4) XAxis
- (near Jump_2x) Jump 2x is OE
- Otto Main
- XXXXXXXXX
- E1
- Labels drawn without touching a wire or pin: SWDIO

### Library data of the parts
C1 C14 C152 = CAP: as C34 on sheet Otto 2
C2 C5 C8 C10 C13 C15 C16 = CAP: as C19 on sheet Otto 2
C3 C4 C9 C11 C12 C17 = CAP: as C20 on sheet Otto 2
C6 = CAP: 06036C104MAZ2A Kyocera 100nf 6.3V 20% 12 cents at Mouser
C7 C18 = CAP: as C21 on sheet Otto 2
C150 C151 C153 = CAP: as C155 on sheet Otto 2
D1 = X1-DFN1006-2: as D2 on sheet Otto 2
J1 = CON4: Standard 0.1in center terminal strip
J300 J301 = 2 PIN .1mm GTK Receptacle_1: as J7 on sheet Otto 2
L1 L2 = INDUCTOR2: MSS7348-103MEC Coilcraft 10uH 3A 45mohm DCR 80cents at Mouser
P1 = UART Xcvr Conn: GTK WTBI-03S-SMH1T-R3 pin R-A 1mm center GTK Header
P2 P4 = 2 PIN .1mm GTK Header: WTBI-02S-SMH1T-R 2pin R-A 1mm center GTK Header
P3 = 2 PIN .1mm GTK Header: WTBI-02S-SMH1T-R  2pin R-A 1mm center GTK Header
R1 R6 R14 = RES1: CR0805-JW-333ELF Bourns 33k 5% .125 4 cents at Mouser
R2 R8 R13 = RES1: CR0805-JW-102ELF Bourns1k 5% .125A 0.5centsat Mouser
R3 R7 R300 R301 = RES1: as R22 on sheet Otto 2
R4 = RES1: CRCW0805100KJNEAC Vishay 100k .125 5% 1.6 cents at Digikey
R5 R9-R12 = RES1: need mew pn --- 0805FR-07150RL (Yageo)
U1 = STM32: STM32WB35CEU6ATR
U2 = BD6231F-E2: BD6231F-E2 Rohm DC Brush Mtr Driver 1.52 at Mouser
U3 = BD6236FM: BD6236FM-E2 DC Brush Mtr Driver 2 CH Rohm 4.34 at Digikey
X1 = XTAL: ECS-320-12-37B-7KM-TR3   Crystal 12 pF ECX-1637B 7/10ppm  35 crnts at Mouser
X2 = XTAL: Pericom 3270004 32KhZ

## Nets that join several sheets
+3.3Vdc: Otto 2 (22 pins), Otto 1 (16 pins)
+6.0Vdc: Otto 2 (5 pins), Otto 1 (8 pins)
GND_1: Otto 2 (35 pins), Otto 1 (25 pins)
GND_2: Otto 2 (8 pins), Otto 1 (35 pins)
NetC14_1: Otto 2 (SW1.2), Otto 1 (C14.1 Jump_2.1 R7.1 U1.7)
NetFilt1_1: Otto 2 (Filt1.1), Otto 1 (U1.27)
NetJ300_1: Otto 2 (U400.11), Otto 1 (J300.1 R300.1)
NetJ301_1: Otto 2 (U400.12), Otto 1 (J301.1 R301.1)
NetR22_2: Otto 2 (R22.2 Term8.1), Otto 1 (U1.47)
NetR23_2: Otto 2 (R23.2), Otto 1 (U1.9)
NetR26_1: Otto 2 (R26.1 U10.10), Otto 1 (U1.19)
NetU1_16: Otto 2 (U4.5 U400.14), Otto 1 (U1.16)
NetU1_17: Otto 2 (U8.11), Otto 1 (U1.17)
NetU1_44: Otto 2 (U4.6 U400.15), Otto 1 (U1.44)
NetU1_45: Otto 2 (U8.12), Otto 1 (U1.45)